# Altium schematic sheet Sheet1.SchDoc
size A4; Organization: Powers Consulting; Address1: robert@; Address2: powersconsulting.com.au; Address3: St Andrews, VIC; Address4: Australia 3761; DocumentNumber: Sch1; Revision: 0.1; SheetNumber: 1; SheetTotal: 1; Email: robert@powersconsulting.com.au
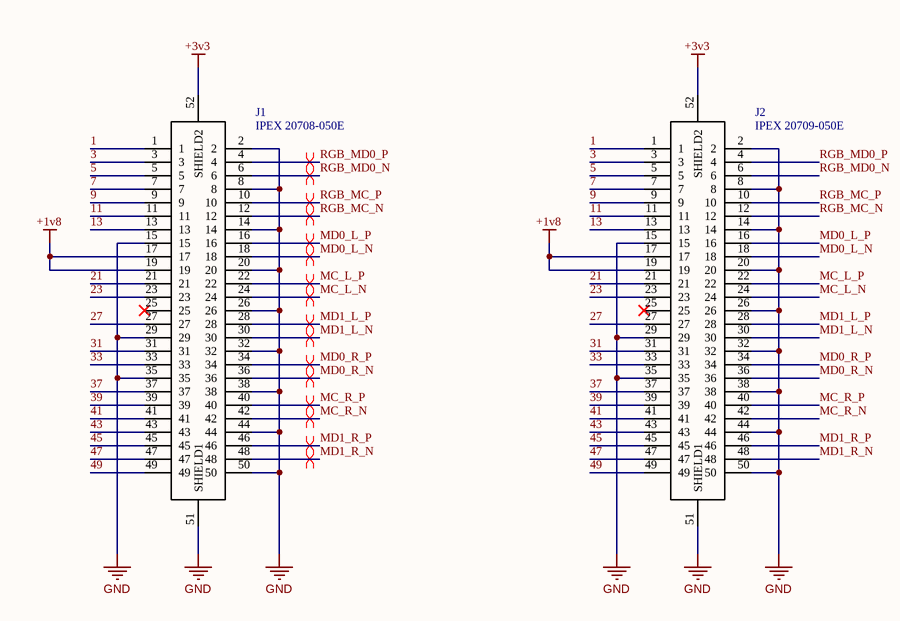
[diagram p0: Sheet1.SchDoc]

## Parts
J1  IPEX 20708-050E  [IPEX_20708-050E-01]
J2  IPEX 20709-050E  [IPEX_20709-050E-01_20709-050E-01(Primary)]

## Nets
+1v8: J1.17 J1.19 J2.17 J2.19
+3v3: J1.52(SHIELD2) J2.52(SHIELD2)
GND: J1.2 J1.8 J1.14 J1.15 J1.20 J1.26 J1.29 J1.32 J1.35 J1.38 J1.44 J1.50 J1.51(SHIELD1) J2.2 J2.8 J2.14 J2.15 J2.20 J2.26 J2.29 J2.32 J2.35 J2.38 J2.44 J2.50 J2.51(SHIELD1)
1: J1.1 J2.1
3: J1.3 J2.3
5: J1.5 J2.5
7: J1.7 J2.7
9: J1.9 J2.9
11: J1.11 J2.11
13: J1.13 J2.13
21: J1.21 J2.21
23: J1.23 J2.23
27: J1.27 J2.27
31: J1.31 J2.31
33: J1.33 J2.33
37: J1.37 J2.37
39: J1.39 J2.39
41: J1.41 J2.41
43: J1.43 J2.43
45: J1.45 J2.45
47: J1.47 J2.47
49: J1.49 J2.49
MC_L_N: J1.24 J2.24
MC_L_P: J1.22 J2.22
MC_R_N: J1.42 J2.42
MC_R_P: J1.40 J2.40
MD0_L_N: J1.18 J2.18
MD0_L_P: J1.16 J2.16
MD0_R_N: J1.36 J2.36
MD0_R_P: J1.34 J2.34
MD1_L_N: J1.30 J2.30
MD1_L_P: J1.28 J2.28
MD1_R_N: J1.48 J2.48
MD1_R_P: J1.46 J2.46
RGB_MC_N: J1.12 J2.12
RGB_MC_P: J1.10 J2.10
RGB_MD0_N: J1.6 J2.6
RGB_MD0_P: J1.4 J2.4

Not connected (* = marked no-connect by the designer): J1 25*; J2 25*

## Layout directives
differential pair; differential pair class MIPI: MC_L_N, MC_L_P, MC_R_N, MC_R_P, MD0_L_N, MD0_L_P, MD0_R_N, MD0_R_P, MD1_L_N, MD1_L_P, MD1_R_N, MD1_R_P, RGB_MC_N, RGB_MC_P, RGB_MD0_N, RGB_MD0_P

## Notes on the sheet
- Title
- Size:
- Date:
- A4
- Number:
- Time:
- Revision:
- Sheet
- of
- File:

## Library data of the parts
J1 = NOVASTACK 35-P 50 Pin Plug: 50-Pin Plug. Mates with 20709-050E.
J2 = NOVASTACK 35-P 50 Pin Receptical: 50-Pin Plug. Mates with 20708-050E.